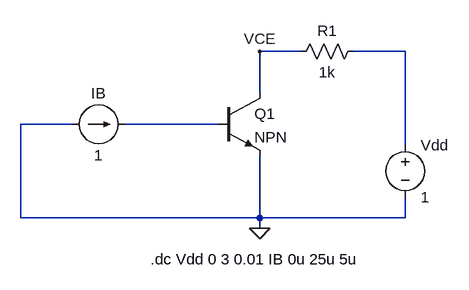
[diagram p0: schematic Task 4 simulation_diagram 2.asc]
Task 4 simulation_diagram 2.asc, the LTspice schematic file:
Version 4
SHEET 1 880 680
WIRE 320 -96 256 -96
WIRE 480 -96 400 -96
WIRE 256 -32 256 -96
WIRE -32 16 -112 16
WIRE 192 16 48 16
WIRE 480 48 480 -96
WIRE -112 160 -112 16
WIRE 256 160 256 64
WIRE 256 160 -112 160
WIRE 480 160 480 128
WIRE 480 160 256 160
WIRE 256 176 256 160
FLAG 256 176 0
FLAG 256 -96 VCE
SYMBOL voltage 480 32 R0
WINDOW 123 0 0 Left 0
WINDOW 39 0 0 Left 0
SYMATTR InstName Vdd
SYMATTR Value 1
SYMBOL current -32 16 R270
WINDOW 0 32 40 VTop 2
WINDOW 3 -32 40 VBottom 2
WINDOW 123 0 0 Left 0
WINDOW 39 0 0 Left 0
SYMATTR InstName IB
SYMATTR Value 1
SYMBOL npn 192 -32 R0
SYMATTR InstName Q1
SYMBOL res 416 -112 R90
WINDOW 0 0 56 VBottom 2
WINDOW 3 32 56 VTop 2
SYMATTR InstName R1
SYMATTR Value 1k
TEXT 88 224 Left 2 !.dc Vdd 0 3 0.01 IB 0u 25u 5u

The netlist it stands for:
* Task 4 simulation_diagram 2.asc
Vdd N001 0 1
IB 0 N002 1
Q1 VCE N002 0 0 NPN
R1 N001 VCE 1k
.model NPN NPN
.model PNP PNP
.lib standard.bjt
.dc Vdd 0 3 0.01 IB 0u 25u 5u
.backanno
.end